# Altium schematic sheet Sheet_1_2023-05-21.schdoc
size 234 x 124 mm
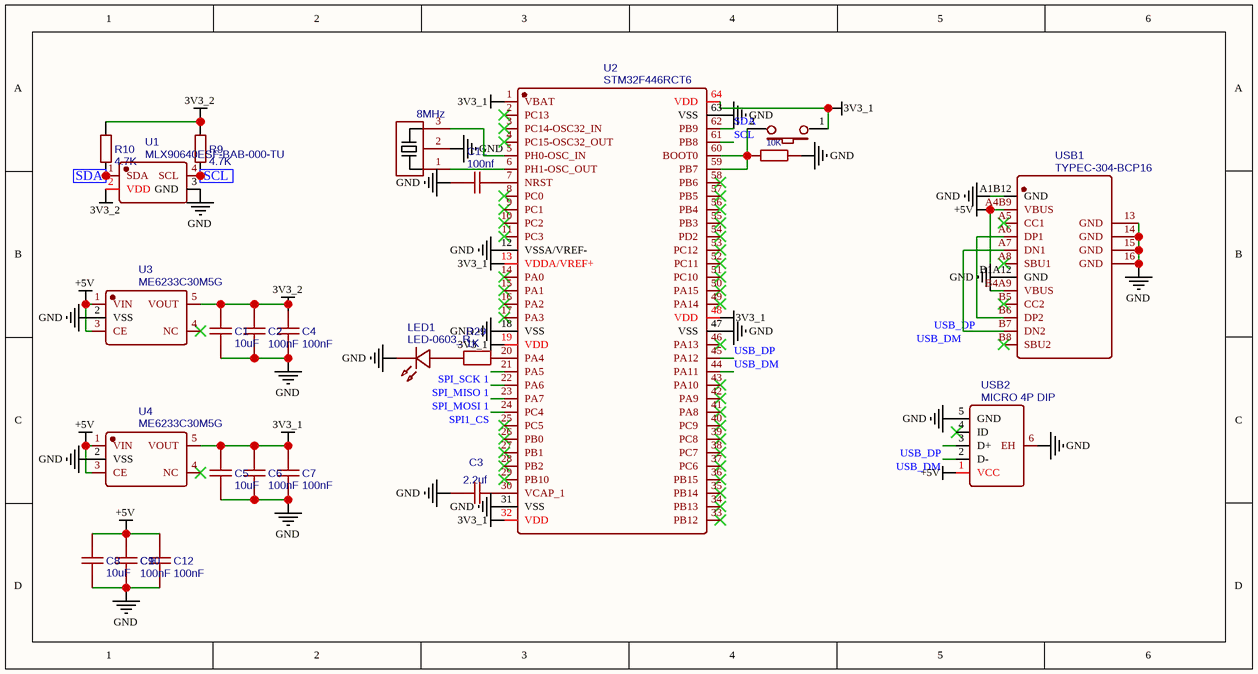
[diagram p0: Sheet_1_2023-05-21.schdoc]

## Parts
BOOT1  两脚小龟 3*4*2  [SW-SMD_L4.0-W2.9-LS5.0]  (value not drawn)
C1  10uF  [C0603]
C2  100nF  [C0603]
C3  2.2uf  [R0402]
C4  100nF  [C0603]
C5  10uF  [C0603]
C6  100nF  [C0603]
C7  100nF  [C0603]
C8  10uF  [C0603]
C10  100nF  [C0603]
C11  100nf  [R0402]
C12  100nF  [C0603]
LED1  LED-0603_R  [LED0603_RED]
R4  10K  [R0402]
R9  4.7K  [R0402]
R10  4.7K  [R0402]
R29  1K  [R0402]
U1  MLX90640ESF-BAB-000-TU  [TO-39-4_MELEXIS_MLX90640]
U2  STM32F446RCT6  [STM32F446]
U3  ME6233C30M5G  [SOT-23-5_L3.0-W1.7-P0.95-LS2.8-BL]
U4  ME6233C30M5G  [SOT-23-5_L3.0-W1.7-P0.95-LS2.8-BL]
USB1  TYPEC-304-BCP16  [USB-C-SMD_TYPEC-304-BCP16]
USB2  MICRO 4P DIP  [MICRO-USB-SMD_MICRO-USB-A5]
X3  8MHz  [X3213]

## Ports
SCL (in), SDA (in)

## Nets
3V3_1: BOOT1.1 C5.2 C6.2 C7.2 U2.1(VBAT) U2.13(VDDA/VREF+) U2.19(VDD) U2.32(VDD) U2.48(VDD) U2.64(VDD) U4.5(VOUT)
3V3_2: C1.2 C2.2 C4.2 R9.2 R10.2 U1.2(VDD) U3.5(VOUT)
+5V: C8.2 C10.2 C12.2 U3.1(VIN) U3.3(CE) U4.1(VIN) U4.3(CE) USB1.A4B9(VBUS) USB1.B4A9(VBUS) USB2.1(VCC)
GND: C1.1 C2.1 C3.2 C4.1 C5.1 C6.1 C7.1 C8.1 C10.1 C11.2 C12.1 LED1.2 R4.1 U1.3(GND) U2.12(VSSA/VREF-) U2.18(VSS) U2.31(VSS) U2.47(VSS) U2.63(VSS) U3.2(VSS) U4.2(VSS) USB1.13(GND) USB1.14(GND) USB1.15(GND) USB1.16(GND) USB1.A1B12(GND) USB1.B1A12(GND) USB2.5(GND) USB2.6(EH) X3.2
SCL: R9.1 U1.4(SCL) ; port SCL
SCL: U2.61(PB8)  [a separate net that carries the same name]
SDA: R10.1 U1.1(SDA) ; port SDA
SDA: U2.62(PB9)  [a separate net that carries the same name]
SPI1_CS: U2.24(PC4)
SPI_MISO 1: U2.22(PA6)
SPI_MOSI 1: U2.23(PA7)
SPI_SCK 1: U2.21(PA5)
USB_DM: U2.44(PA11) USB1.A7(DN1) USB1.B7(DN2) USB2.2(D-)
USB_DP: U2.45(PA12) USB1.A6(DP1) USB1.B6(DP2) USB2.3(D+)
NetBOOT1_2: BOOT1.2 R4.2 U2.59(PB7) U2.60(BOOT0)
NetC3_1: C3.1 U2.30(VCAP_1)
NetC11_1: C11.1 U2.7(NRST)
NetLED1_1: LED1.1 R29.2
NetR29_1: R29.1 U2.20(PA4)
NetU2_5: U2.5(PH0-OSC_IN) X3.3
NetU2_6: U2.6(PH1-OSC_OUT) X3.1

Not connected (* = marked no-connect by the designer): U2 2(PC13)* 3(PC14-OSC32_IN)* 4(PC15-OSC32_OUT)* 8(PC0)* 9(PC1)* 10(PC2)* 11(PC3)* 14(PA0)* 15(PA1)* 16(PA2)* 17(PA3)* 25(PC5)* 26(PB0)* 27(PB1)* 28(PB2)* 29(PB10)* 33(PB12)* 34(PB13)* 35(PB14)* 36(PB15)* 37(PC6)* 38(PC7)* 39(PC8)* 40(PC9)* 41(PA8)* 42(PA9)* 43(PA10)* 46(PA13)* 49(PA14)* 50(PA15)* 51(PC10)* 52(PC11)* 53(PC12)* 54(PD2)* 55(PB3)* 56(PB4)* 57(PB5)* 58(PB6)*; U3 4(NC)*; U4 4(NC)*; USB1 A5(CC1)* A8(SBU1)* B5(CC2)* B8(SBU2)*; USB2 4(ID)*

## Notes on the sheet
- C9

## Library data of the parts
BOOT1 = 两脚小龟 3*4*2: BOM_Manufacturer: null; Contributor: LCSC; BOM_Supplier: LCSC; BOM_Supplier Part: C2837315; BOM_Manufacturer Part: 两脚小龟 3*4*2; BOM_JLCPCB Part Class: Extended Part; spicePre: U; spiceSymbolName: 两脚小龟 3*4*2
C1 C5 C8 = 10uF: BOM_Manufacturer: SAMSUNG(三星); BOM_Manufacturer Part: CL10A106KP8NNNC; nameAlias: Capacitance; BOM_Supplier: LCSC; BOM_Supplier Part: C19702; BOM_JLCPCB Part Class: Basic Part; spicePre: C; spiceSymbolName: CL10A106KP8NNNC
C2 C4 C6 C7 C10 C12 = 100nF: BOM_Manufacturer: YAGEO(国巨); BOM_Manufacturer Part: CC0603KRX7R9BB104; nameAlias: Capacitance; BOM_Supplier: LCSC; BOM_Supplier Part: C14663; BOM_JLCPCB Part Class: Basic Part; spicePre: C; spiceSymbolName: CC0603KRX7R9BB104
C3 = 2.2uf: nameAlias: Value(F); Contributor: LCEDA_Lib; BOM_Supplier Part: C12530; BOM_Supplier: LCSC; spicePre: C; spiceSymbolName: C_0603_US; JLCPCB Part Class: Basic Part
C11 = 100nf: nameAlias: Value(F); Contributor: LCEDA_Lib; BOM_Supplier Part: C1525; spicePre: C; spiceSymbolName: C_0603_US
LED1 = LED-0603_R: BOM_Manufacturer: EVERLIGHT(台湾亿光); BOM_Manufacturer Part: 19-217/R6C-AL1M2VY/3T; Contributor: LCEDA_01; BOM_Supplier Part: C72044; BOM_Supplier: LCSC; spicePre: L; spiceSymbolName: LED-0603_R
R4 = 10K: nameAlias: Resistance (Ohms); Contributor: LCSC; BOM_Supplier: LCSC; BOM_Supplier Part: C25744; spicePre: R; spiceSymbolName: TC0225B1002TCE; Resistance: 10K; JLCPCB Part Class: Basic Part
R9 R10 = 4.7K: nameAlias: Resistance (Ohms); BOM_Supplier: LCSC; BOM_Supplier Part: C25900; Resistance: 4.7K; spicePre: R; spiceSymbolName: RC0402FR-074K7L; JLCPCB Part Class: Basic Part
R29 = 1K: nameAlias: Value(Ω); Contributor: LCEDA_Lib; BOM_Supplier Part: C11702; BOM_Supplier: LCSC; spicePre: R; spiceSymbolName: R_0402_EU; Resistance: 1K; JLCPCB Part Class: Basic Part
U1 = MLX90640ESF-BAB-000-TU: BOM_Manufacturer: Melexis(比利时迈来芯); Contributor: lcsc; BOM_Supplier: LCSC; BOM_Supplier Part: C488251; BOM_Manufacturer Part: MLX90640ESF-BAB-000-TU; link: https://atta.szlcsc.com/upload/public/pdf/source/20200318/C488251_85813F440C116665020FF93BD24900EE.pdf; spicePre: U; spiceSymbolName: MLX90640ESF-BAB-000-TU
U2 = STM32F446RCT6: BOM_Manufacturer: ST(意法半导体); Contributor: LCSC; BOM_Supplier: LCSC; BOM_Supplier Part: C915971; BOM_Manufacturer Part: STM32F446RCT6; BOM_JLCPCB Part Class: Extended Part; spicePre: U; spiceSymbolName: STM32F446RCT6
U3 U4 = ME6233C30M5G: BOM_Manufacturer: MICRONE(南京微盟); Contributor: lcsc; BOM_Supplier: LCSC; BOM_Supplier Part: C2925777; BOM_Manufacturer Part: ME6233C30M5G; link: https://atta.szlcsc.com/upload/public/pdf/source/20220307/226B04796686261F8C59D4626A2C7A45.pdf; spicePre: U; spiceSymbolName: ME6233C30M5G
USB1 = TYPEC-304-BCP16: BOM_Manufacturer: XUNPU; Contributor: LCSC; BOM_Supplier: LCSC; BOM_Supplier Part: C720629; BOM_Manufacturer Part: TYPEC-304-BCP16; BOM_JLCPCB Part Class: Extended Part; spicePre: U; spiceSymbolName: TYPEC-304-BCP16
USB2 = MICRO 4P DIP: BOM_Manufacturer: SHOU HAN; Contributor: LCSC; BOM_Supplier: LCSC; BOM_Supplier Part: C456008; BOM_Manufacturer Part: MICRO 4P DIP; spicePre: U; spiceSymbolName: MICRO 4P DIP
X3 = 8MHz: BOM_Manufacturer: MuRata; BOM_Manufacturer Part: CSTCE8M00G55A-R0; nameAlias: Frequency; BOM_Supplier: LCSC; BOM_Supplier Part: C91587; spicePre: X; spiceSymbolName: CSTCE8M00G55A-R0